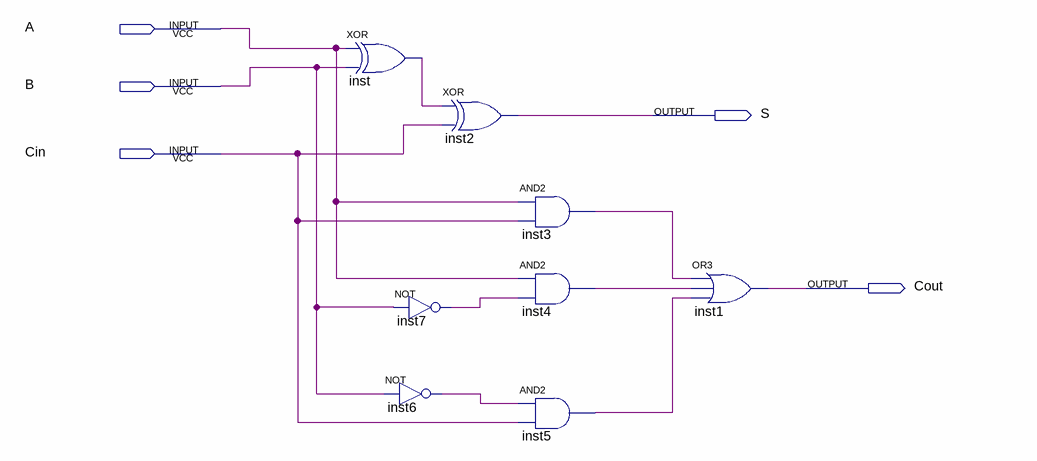
[diagram p0: schematic sheet]
// Quartus schematic subtratorb-a.bdf as structural Verilog: 8 symbols, 5 pins
module \subtratorb-a  (
  input  A,
  input  B,
  input  Cin,
  output S,
  output Cout
);

  wire inst3_out, inst4_out, inst5_out, inst6_out, inst7_out, inst_out;

  xor inst (inst_out, A, B);
  not inst7 (inst7_out, B);
  not inst6 (inst6_out, B);
  xor inst2 (S, inst_out, Cin);
  and inst3 (inst3_out, A, Cin);
  and inst4 (inst4_out, A, inst7_out);
  and inst5 (inst5_out, inst6_out, Cin);
  or inst1 (Cout, inst3_out, inst4_out, inst5_out);
endmodule
